# EAGLE design Power Board V2 (EAGLE 7.6.0)
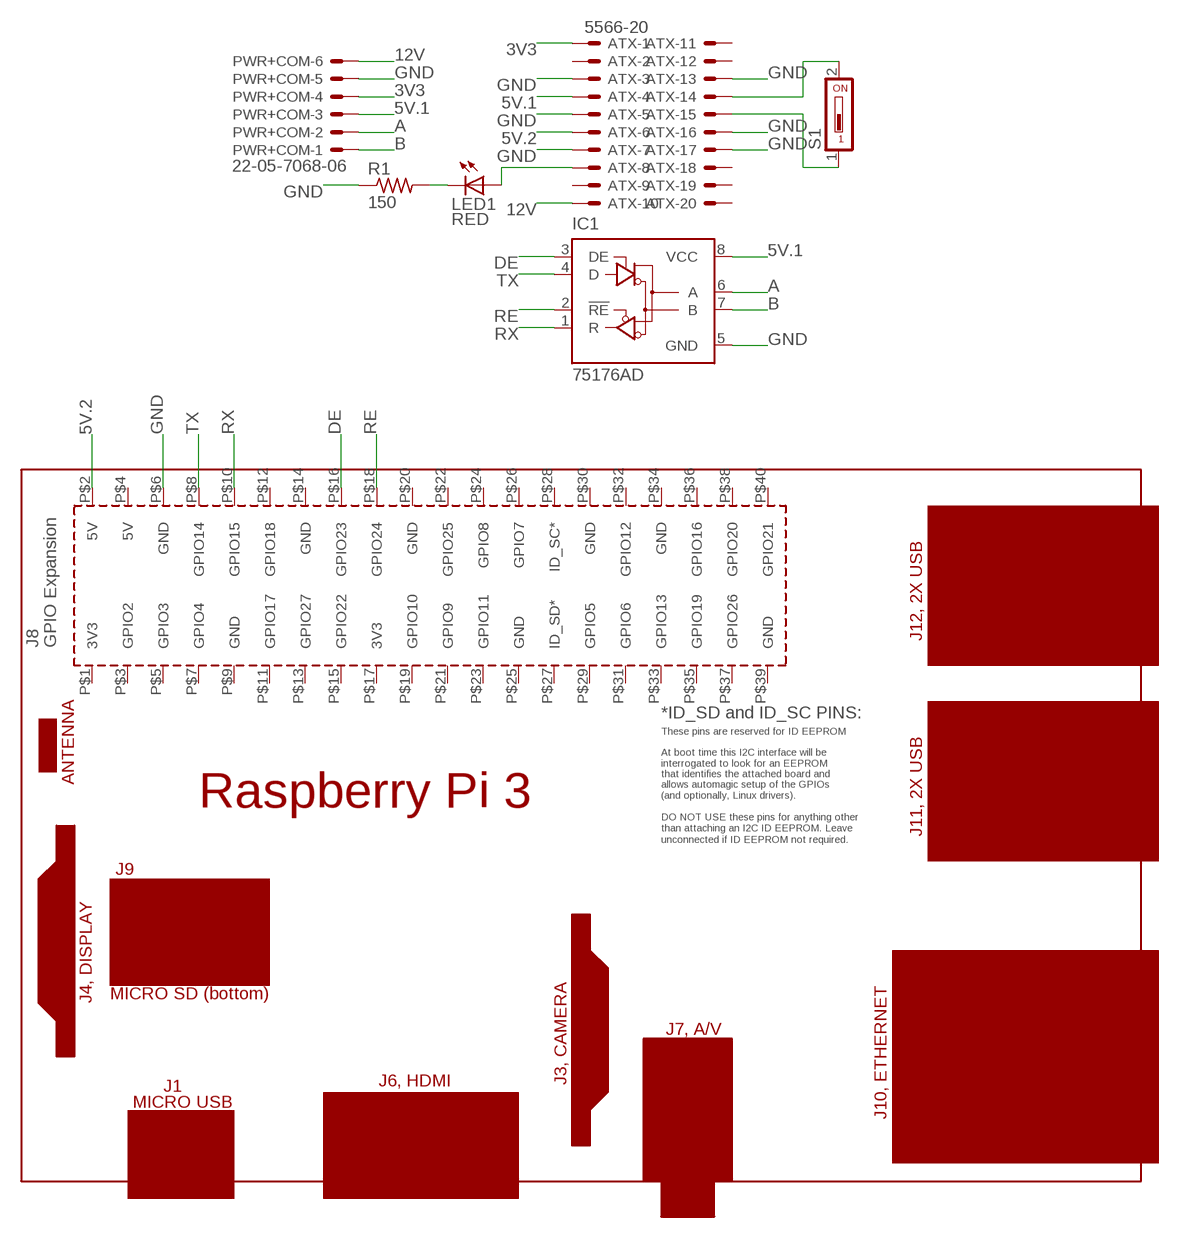
[diagram p0: schematic, sheet 1]

## Parts
ATX  5566-20  [5566-20]
IC1  75176AD  [D_R-PDSO-G8]
LED1  RED  LEDCHIPLED_1206  [CHIPLED_1206]
PCB1  RPI3  [RPI3]
PWR+COM  22-05-7068-06  [7395-06]
R1  150  R-US_R0805  [R0805]
S1  SD4-01  [SD4-01]

## Nets
3V3: ATX.1 PWR+COM.4
5V.1: ATX.4 IC1.8(VCC) PWR+COM.3
5V.2: ATX.6 PCB1.P$2(5V)
12V: ATX.10 PWR+COM.6
A: IC1.6(A) PWR+COM.2
B: IC1.7(B) PWR+COM.1
DE: IC1.3(DE) PCB1.P$16(GPIO23)
GND: ATX.3 ATX.5 ATX.7 ATX.13 ATX.16 ATX.17 IC1.5(GND) PCB1.P$6(GND) PWR+COM.5 R1.1
N$1: ATX.14 S1.2
N$2: ATX.15 S1.1
N$3: ATX.8 LED1.A
N$4: LED1.C R1.2
RE: IC1.2(!RE) PCB1.P$18(GPIO24)
RX: IC1.1(R) PCB1.P$10(GPIO15)
TX: IC1.4(D) PCB1.P$8(GPIO14)
Unconnected: ATX.2 ATX.9 ATX.11 ATX.12 ATX.18 ATX.19 ATX.20 PCB1.P$1(3V3) PCB1.P$3(GPIO2) PCB1.P$4(5V) PCB1.P$5(GPIO3) PCB1.P$7(GPIO4) PCB1.P$9(GND) PCB1.P$11(GPIO17) PCB1.P$12(GPIO18) PCB1.P$13(GPIO27) PCB1.P$14(GND) PCB1.P$15(GPIO22) PCB1.P$17(3V3) PCB1.P$19(GPIO10) PCB1.P$20(GND) PCB1.P$21(GPIO9) PCB1.P$22(GPIO25) PCB1.P$23(GPIO11) PCB1.P$24(GPIO8) PCB1.P$25(GND) PCB1.P$26(GPIO7) PCB1.P$27(ID_SD*) PCB1.P$28(ID_SC*) PCB1.P$29(GPIO5) PCB1.P$30(GND) PCB1.P$31(GPIO6) PCB1.P$32(GPIO12) PCB1.P$33(GPIO13) PCB1.P$34(GND) PCB1.P$35(GPIO19) PCB1.P$36(GPIO16) PCB1.P$37(GPIO26) PCB1.P$38(GPIO20) PCB1.P$39(GND) PCB1.P$40(GPIO21)

## Library data of the parts
ATX = con-molex:5566-20: Mini FIT connector 20 pol ATX PC-Motherboard Power connector Source: http://www.molex.com; OC_FARNELL: unknown; OC_NEWARK: unknown
IC1 = 751xx:75176A: DIFFERENTIAL BUS TRANSCEIVER Source: http://focus.ti.com/lit/ds/symlink/sn75176a.pdf
LED1 = led:LED: LED OSRAM: - CHIPLED LG R971, LG N971, LY N971, LG Q971, LY Q971, LO R971, LY R971 LH N974, LH R974 LS Q976, LO Q976, LY Q976 LO Q996 - Hyper CHIPLED LW Q18S LB Q993, LB Q99A, LB R99A - SideLED LS A670, LO A670, LY A670, LG A670, LP A670 LB A673, LV A673, LT A673, LW A673 LH A674 LY A675 LS A676, LA A676, LO A676, LY A676, LW A676 LS A679, LY A679, LG A679 - Hyper Micro SIDELED® LS Y876, LA Y876, LO Y876, LY Y876 LT Y87S - SmartLED LW L88C, LW L88S LB L89C, LB L89S, LG L890 LS L89K, LO L89K, LY L89K LS L896, LA L896, LO L896, LY L896 - TOPLED LS T670, LO T670, LY T670, LG T670, LP T670 LSG T670, LSP T670, LSY T670, LOP T670, LYG T670 LG T671, LOG T671, LSG T671 LB T673, LV T673, LT T673, LW T673 LH T674 LS T676, LA T676, LO T676, LY T676, LB T676, LH T676, LSB T676, LW T676 LB T67C, LV T67C, LT T67C, LS T67K, LO T67K, LY T67K, LW E67C LS E67B, LA E67B, LO E67B, LY E67B, LB E67C, LV E67C, LT E67C LW T67C LS T679, LY T679, LG T679 LS T770, LO T770, LY T770, LG T770, LP T770 LB T773, LV T773, LT T773, LW T773 LH T774 LS E675, LA E675, LY E675, LS T675 LS T776, LA T776, LO T776, LY T776, LB T776 LHGB T686 LT T68C, LB T68C - Hyper Mini TOPLED® LB M676 - Mini TOPLED Santana® LG M470 LS M47K, LO M47K, LY M47K Source: http://www.osram.convergy.de LUXEON: - LUMILED® LXK2-PW12-R00, LXK2-PW12-S00, LXK2-PW14-U00, LXK2-PW14-V00 LXK2-PM12-R00, LXK2-PM12-S00, LXK2-PM14-U00 LXK2-PE12-Q00, LXK2-PE12-R00, LXK2-PE12-S00, LXK2-PE14-T00, LXK2-PE14-U00 LXK2-PB12-K00, LXK2-PB12-L00, LXK2-PB12-M00, LXK2-PB14-N00, LXK2-PB14-P00, LXK2-PB14-Q00 LXK2-PR12-L00, LXK2-PR12-M00, LXK2-PR14-Q00, LXK2-PR14-R00 LXK2-PD12-Q00, LXK2-PD12-R00, LXK2-PD12-S00 LXK2-PH12-R00, LXK2-PH12-S00 LXK2-PL12-P00, LXK2-PL12-Q00, LXK2-PL12-R00 Source: www.luxeon.com KINGBRIGHT: KA-3528ASYC Source: www.kingbright.com
PCB1 = e14_Rpi3_RevA:RPI3: Device for Raspberry Pi 3 board created by Dave Young for www.element14.com More information and support community is available at https://www.element14.com/community/community/raspberry-pi
PWR+COM = con-molex:22-?-06: CONNECTOR wire to board 2.54 mm (.1 inch) pitch header; OC_FARNELL: unknown; OC_NEWARK: unknown
R1 = resistor:R-US_: RESISTOR, American symbol
S1 = switch-dil:SD4-01: DIL/CODE SWITCH; OC_FARNELL: unknown; OC_NEWARK: unknown

## Board
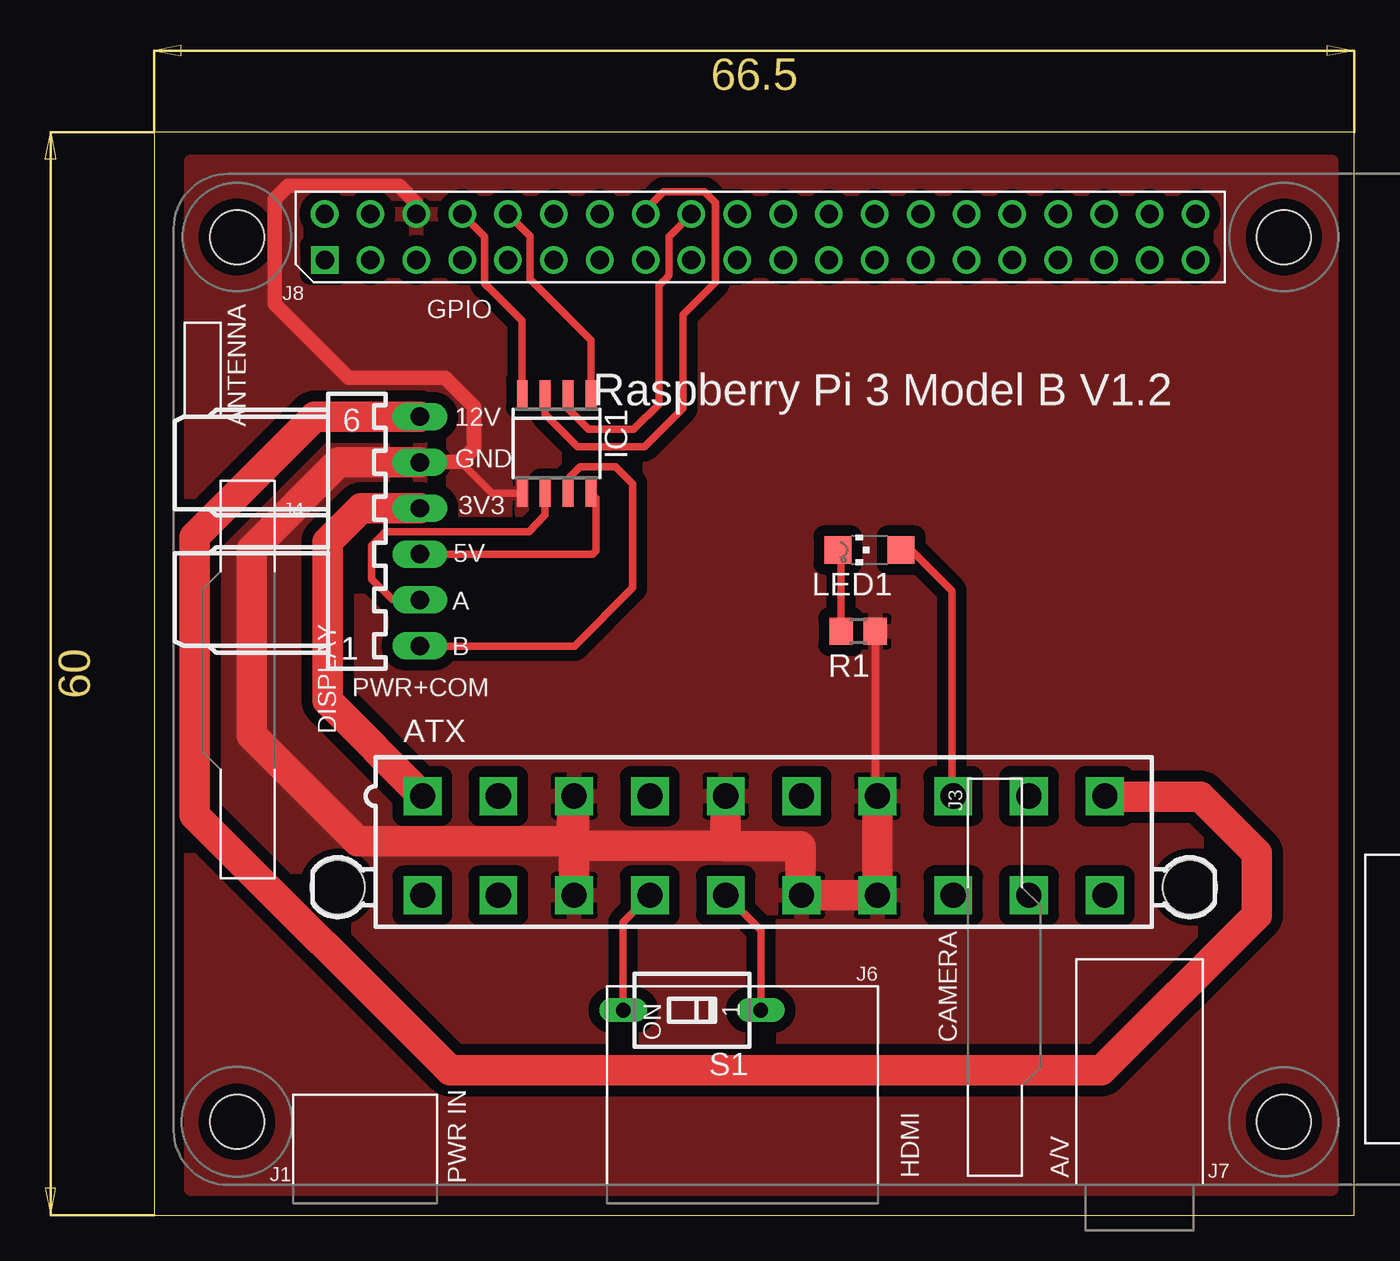
[diagram p1: board, top side]
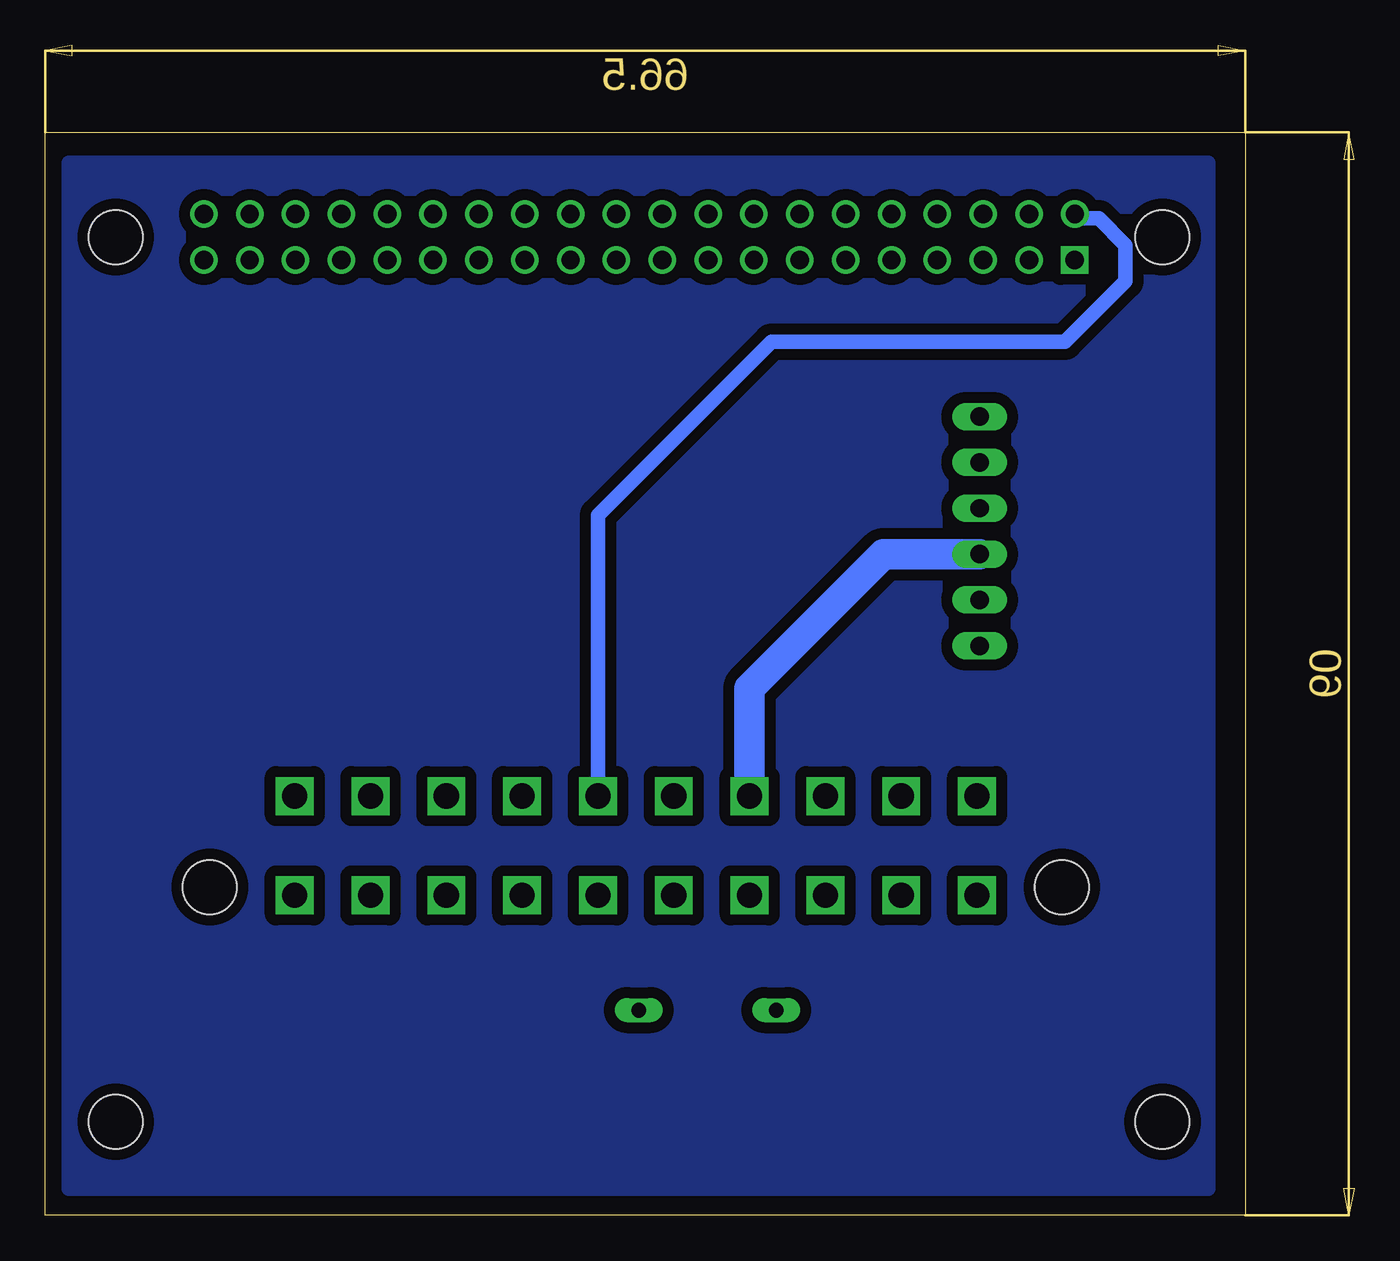
[diagram p2: board, bottom side, seen from below]

Size 66.5 x 60 mm. Coordinates in mm from the lower left corner, seen from the top.
Outline: 0,0 66.5,0 66.5,60 0,60 0,0
Copper layers (1*16): Top 0.035mm / dielectric 1.5mm / Bottom 0.035mm
Design rules "trax_discount_template": minimum track width 10mil, minimum drill 0.25mil, track to track 0.25mm, track to pad 0.25mm, pad to pad 0.25mm, via to via 0.25mm, smd to smd 0.25mm, copper to edge 0.25mm, drill to drill 0.3mm, minimum pad ring 10mil, minimum via ring 8mil, stop-mask expansion 4mil, vias tented up to drill 0mil, thermal gap 10mil

### Footprints (pad centres in the part's own frame; a part is rotated, then mirrored left to right if it is on the bottom)
5566-20 = drill 1.4 square: 1 18.9,-2.75; 2 14.7,-2.75; 3 10.5,-2.75; 4 6.3,-2.75; 5 2.1,-2.75; 6 -2.1,-2.75; 7 -6.3,-2.75; 8 -10.5,-2.75; 9 -14.7,-2.75; 10 -18.9,-2.75; 11 18.9,2.75; 12 14.7,2.75; 13 10.5,2.75; 14 6.3,2.75; 15 2.1,2.75; 16 -2.1,2.75; 17 -6.3,2.75; 18 -10.5,2.75; 19 -14.7,2.75; 20 -18.9,2.75 | hole 3: 23.6,2.29; -23.6,2.29
D_R-PDSO-G8 = smd 0.6 x 1.5: 1 -1.905,-2.75; 2 -0.635,-2.75; 3 0.635,-2.75; 4 1.905,-2.75; 5 1.905,2.75; 6 0.635,2.75; 7 -0.635,2.75; 8 -1.905,2.75
CHIPLED_1206 = smd 1.5 x 1.5: A 0,-1.75; C 0,1.75
RPI3 = drill 1.016 square: P$1 8.37,51.23 | drill 1.016: P$2 8.357,53.772; P$3 10.897,51.232; P$4 10.897,53.772; P$5 13.437,51.232; P$6 13.437,53.772; P$7 15.977,51.232; P$8 15.977,53.772; P$9 18.517,51.232; P$10 18.517,53.772; P$11 21.057,51.232; P$12 21.057,53.772; P$13 23.597,51.232; P$14 23.597,53.772; P$15 26.137,51.232; P$16 26.137,53.772; P$17 28.677,51.232; P$18 28.677,53.772; P$19 31.217,51.232; P$20 31.217,53.772; P$21 33.757,51.232; P$22 33.757,53.772; P$23 36.297,51.232; P$24 36.297,53.772; P$25 38.837,51.232; P$26 38.837,53.772; P$27 41.377,51.232; P$28 41.377,53.772; P$29 43.917,51.232; P$30 43.917,53.772; P$31 46.457,51.232; P$32 46.457,53.772; P$33 48.997,51.232; P$34 48.997,53.772; P$35 51.537,51.232; P$36 51.537,53.772; P$37 54.077,51.232; P$38 54.077,53.772; P$39 56.617,51.232; P$40 56.617,53.772 | hole 3: 3.5,3.5; 61.5,3.5; 3.5,52.5; 61.5,52.5
7395-06 = drill 1.016 long: 1 6.35,0; 2 3.81,0; 3 1.27,0; 4 -1.27,0; 5 -3.81,0; 6 -6.35,0
R0805 = smd 1.3 x 1.5: 1 -0.95,0; 2 0.95,0
SD4-01 = drill 0.813 long: 1 0,-3.81; 2 0,3.81

### Placement (x,y rotation side)
ATX  33.77,20.48 180 top
IC1  22.3,42.76 180 top
LED1  39.63,36.86 90 top
PCB1  1.09,1.69 0 top
PWR+COM  14.73,37.9 270 top
R1  39.01,32.35 180 top
S1  29.8,11.37 90 top

### Tracks (layer width: path | path; a pad name or v marks a point on that pad's centre or on a via)
3V3
  Top 1.676: PWR+COM.4 11.46,39.17 9.6,37.31 9.6,28.5 ATX.1
5V.1
  Top 0.406: PWR+COM.3 24.29,36.63 24.49,36.83 24.49,39.73 IC1.8
  Bottom 1.676: ATX.4 27.47,29.21 20.05,36.63 PWR+COM.3
5V.2
  Bottom 0.813: ATX.6 35.87,38.78 26.26,48.39 9.99,48.39 6.64,51.74 6.64,53.74 8.12,55.22 9.21,55.22 PCB1.P$2
12V
  Top 1.676: PWR+COM.6 8.89,44.25 2.24,37.6 2.24,22.18 16.39,8.03 52.48,8.03 61.08,16.63 61.08,20.07 57.97,23.18 52.72,23.18 ATX.10
A
  Top 0.406: PWR+COM.2 13.2,34.09 12.04,35.25 12.04,37.09 12.71,37.76 12.71,37.78 12.83,37.86 20.77,37.86 21.67,38.8 IC1.6
B
  Top 0.406: IC1.7 22.93,40.8 23.61,41.48 25.55,41.48 26.51,40.52 26.51,34.77 23.28,31.54 PWR+COM.1
DE
  Top 0.406: IC1.3 21.66,44.37 23.46,42.57 27.16,42.57 29.3,44.71 29.3,49.89 31.1,51.69 31.1,56.09 30.48,56.71 28.22,56.71 27.23,55.72 PCB1.P$16
GND
  Top 0.406: IC1.5 18.73,40.01 16.99,41.75 | R1.1 39.96,23.34 ATX.7
  Top 0.813: PCB1.P$6 14.53,56.06 13.56,57.03 7.43,57.03 6.68,56.28 6.68,50.51 10.78,46.41 16.11,46.41 17.74,44.78 17.74,42.5 16.99,41.75 14.77,41.75 PWR+COM.5
  Top 1.676: PWR+COM.5 10.23,41.71 5.4,36.88 5.4,26.6 11.27,20.73 23.16,20.73 | 23.16,20.73 23.16,23.12 ATX.3 23.27,20.99 23.11,20.83 23.11,20.54 23.06,20.49 31.67,20.49 | ATX.13 23.27,20.62 23.16,20.73 | 31.67,20.49 ATX.5 | 31.67,20.49 31.67,20.46 35.8,20.46 35.8,17.73 ATX.16 ATX.17 ATX.7
  pour Top (isolate 0.61): 2.06,58.35 65.21,58.35 65.21,1.49 2.06,1.49
N$1
  Top 0.406: S1.2 25.99,16.25 ATX.14
N$2
  Top 0.406: S1.1 33.61,15.79 ATX.15
N$3
  Top 0.406: LED1.A 41.93,36.86 44.2,34.59 44.2,23.3 ATX.8
N$4
  Top 0.406: R1.2 38.06,36.68 LED1.C
N$5
  pour Bottom (isolate 0.61): 2.06,58.3 65.2,58.3 65.2,1.49 2.06,1.49
RE
  Top 0.406: IC1.2 22.93,44.69 24.08,43.54 26.57,43.54 27.97,44.94 27.97,51.51 28.43,51.97 28.43,51.99 28.52,52.08 28.52,54.22 PCB1.P$18
RX
  Top 0.406: IC1.1 24.2,48.48 20.82,51.86 20.82,54.25 PCB1.P$10
TX
  Top 0.406: IC1.4 20.39,49.55 18.47,51.47 18.46,51.47 18.32,51.61 18.32,54.21 PCB1.P$8

### Text on the board
tPlace: 12V | GND | 3V3 | 5V | A | B